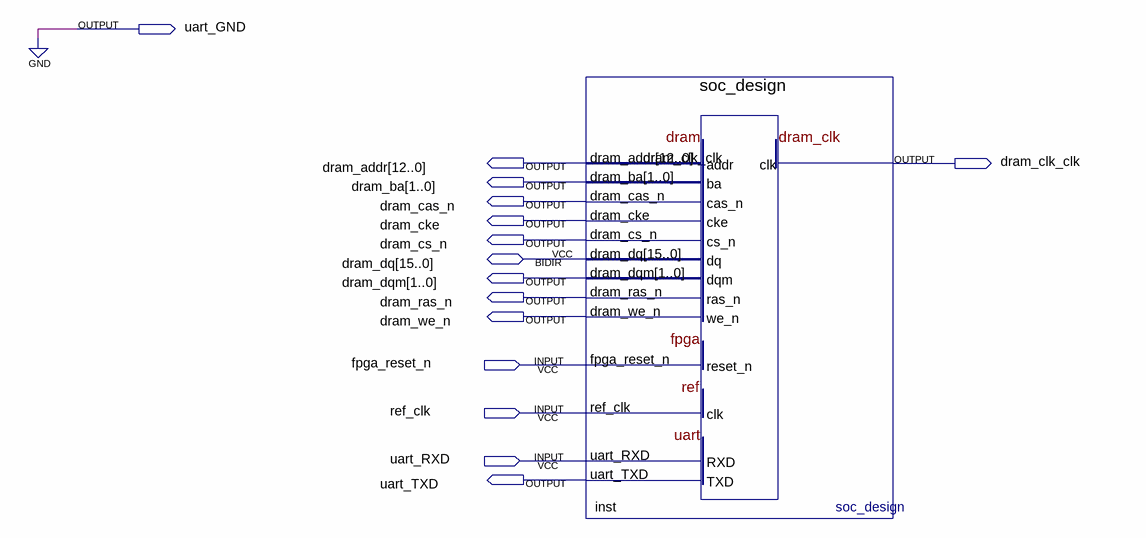
[diagram p0: schematic sheet]
// Quartus schematic chris_proj.bdf as structural Verilog: 1 symbols, 15 pins
module chris_proj (
  input  fpga_reset_n,
  input  ref_clk,
  input  uart_RXD,
  inout  [15:0] dram_dq,
  output uart_GND,
  output [12:0] dram_addr,
  output dram_clk_clk,
  output [1:0] dram_ba,
  output dram_cas_n,
  output dram_cke,
  output dram_cs_n,
  output [1:0] dram_dqm,
  output dram_ras_n,
  output dram_we_n,
  output uart_TXD
);

  soc_design inst (
    .fpga_reset_n(fpga_reset_n), .ref_clk(ref_clk), .uart_RXD(uart_RXD), .dram_addr(dram_addr),
    .dram_ba(dram_ba), .dram_cas_n(dram_cas_n), .dram_cke(dram_cke), .dram_cs_n(dram_cs_n),
    .dram_dqm(dram_dqm), .dram_ras_n(dram_ras_n), .dram_we_n(dram_we_n), .dram_clk_clk(dram_clk_clk),
    .uart_TXD(uart_TXD), .dram_dq(dram_dq));

  assign uart_GND = 1'b0;
endmodule
